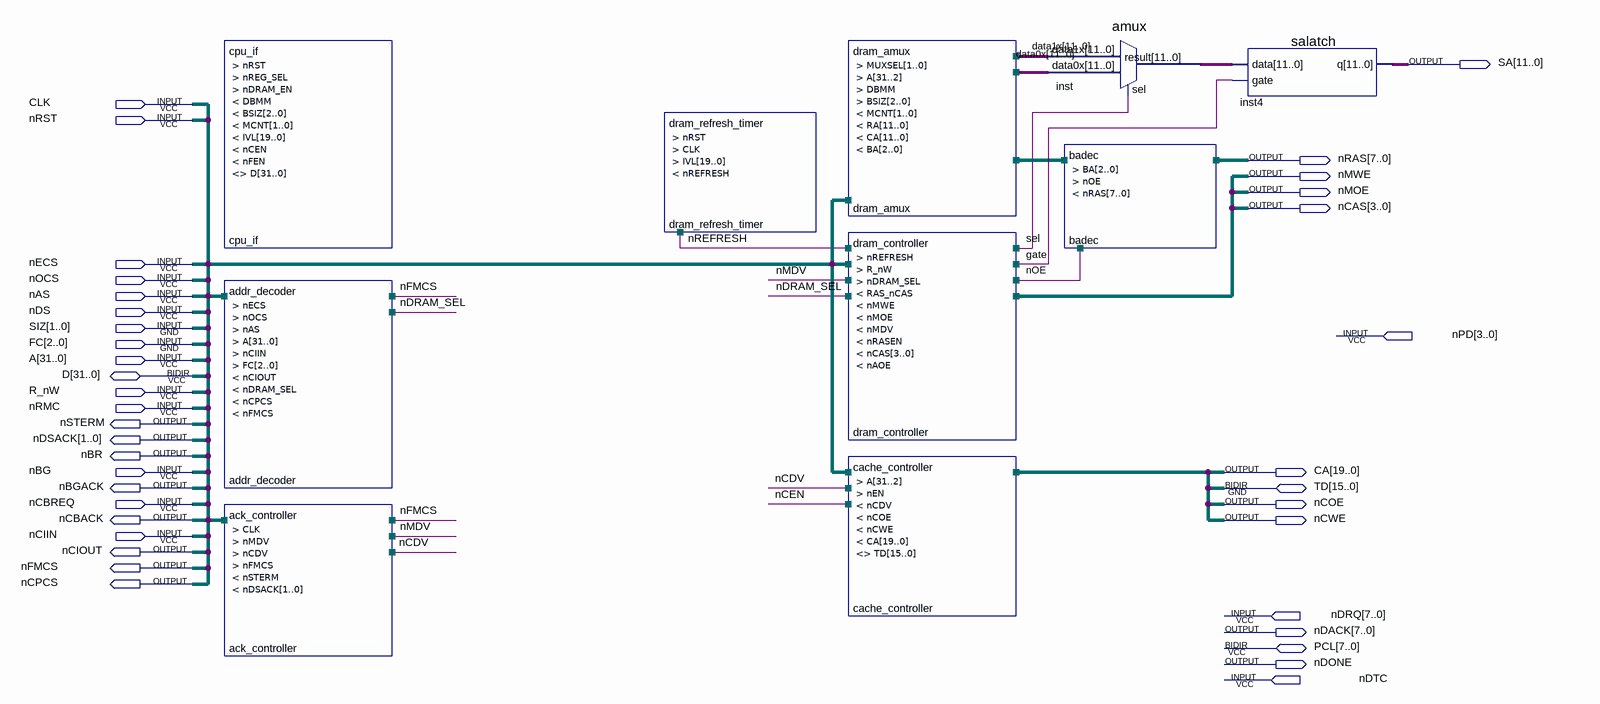
[diagram p0: schematic sheet]
// Quartus schematic cdc.bdf as structural Verilog: 10 symbols, 38 pins
module cdc (
  input  CLK,
  input  nRST,
  input  nECS,
  input  nOCS,
  input  nAS,
  input  nDS,
  input  [1:0] SIZ,
  input  [3:0] nPD,
  input  [2:0] FC,
  input  [31:0] A,
  input  R_nW,
  input  nRMC,
  input  nBG,
  input  nCBREQ,
  input  nCIIN,
  input  [7:0] nDRQ,
  input  nDTC,
  inout  [31:0] D,
  inout  [15:0] TD,
  inout  [7:0] PCL,
  output [11:0] SA,
  output [7:0] nRAS,
  output nMWE,
  output nMOE,
  output [3:0] nCAS,
  output nSTERM,
  output [1:0] nDSACK,
  output nBR,
  output [19:0] CA,
  output nBGACK,
  output nCOE,
  output nCBACK,
  output nCWE,
  output nCIOUT,
  output nFMCS,
  output nCPCS,
  output [7:0] nDACK,
  output nDONE
);

  wire gate, nCDV, nCEN, nDRAM_SEL, nMDV, nOE, nREFRESH, sel;
  wire [2:0] BA;
  wire [11:0] data0x, data1x, inst_result;

  cpu_if cpu_if ();  // open: nRST, nREG_SEL, nDRAM_EN, DBMM, BSIZ, MCNT, IVL, nCEN, nFEN, D
  addr_decoder addr_decoder (
    .nECS(nECS), .nOCS(nOCS), .nAS(nAS), .A(A), .nCIIN(nCIIN), .FC(FC), .nCIOUT(nCIOUT),
    .nDRAM_SEL(nDRAM_SEL), .nCPCS(nCPCS), .nFMCS(nFMCS));
  ack_controller ack_controller (.CLK(CLK), .nMDV(nMDV), .nCDV(nCDV), .nFMCS(nFMCS), .nSTERM(nSTERM), .nDSACK(nDSACK));
  dram_refresh_timer dram_refresh_timer (.nREFRESH(nREFRESH));  // open: nRST, CLK, IVL
  dram_amux dram_amux (.A(A[31:2]), .RA(data0x), .CA(data1x), .BA(BA));  // open: MUXSEL, DBMM, BSIZ, MCNT
  dram_controller dram_controller (
    .nREFRESH(nREFRESH), .R_nW(R_nW), .nDRAM_SEL(nDRAM_SEL), .RAS_nCAS(sel), .nMWE(nMWE), .nMOE(nMOE),
    .nMDV(nMDV), .nRASEN(nOE), .nCAS(nCAS), .nAOE(gate));
  cache_controller cache_controller (.A(A[31:2]), .nEN(nCEN), .nCDV(nCDV), .nCOE(nCOE), .nCWE(nCWE), .CA(CA), .TD(TD));
  amux inst (.data1x(data1x), .data0x(data0x), .sel(sel), .result(inst_result));
  badec badec (.BA(BA), .nOE(nOE), .nRAS(nRAS));
  salatch inst4 (.data(inst_result), .gate(gate), .q(SA));
endmodule
